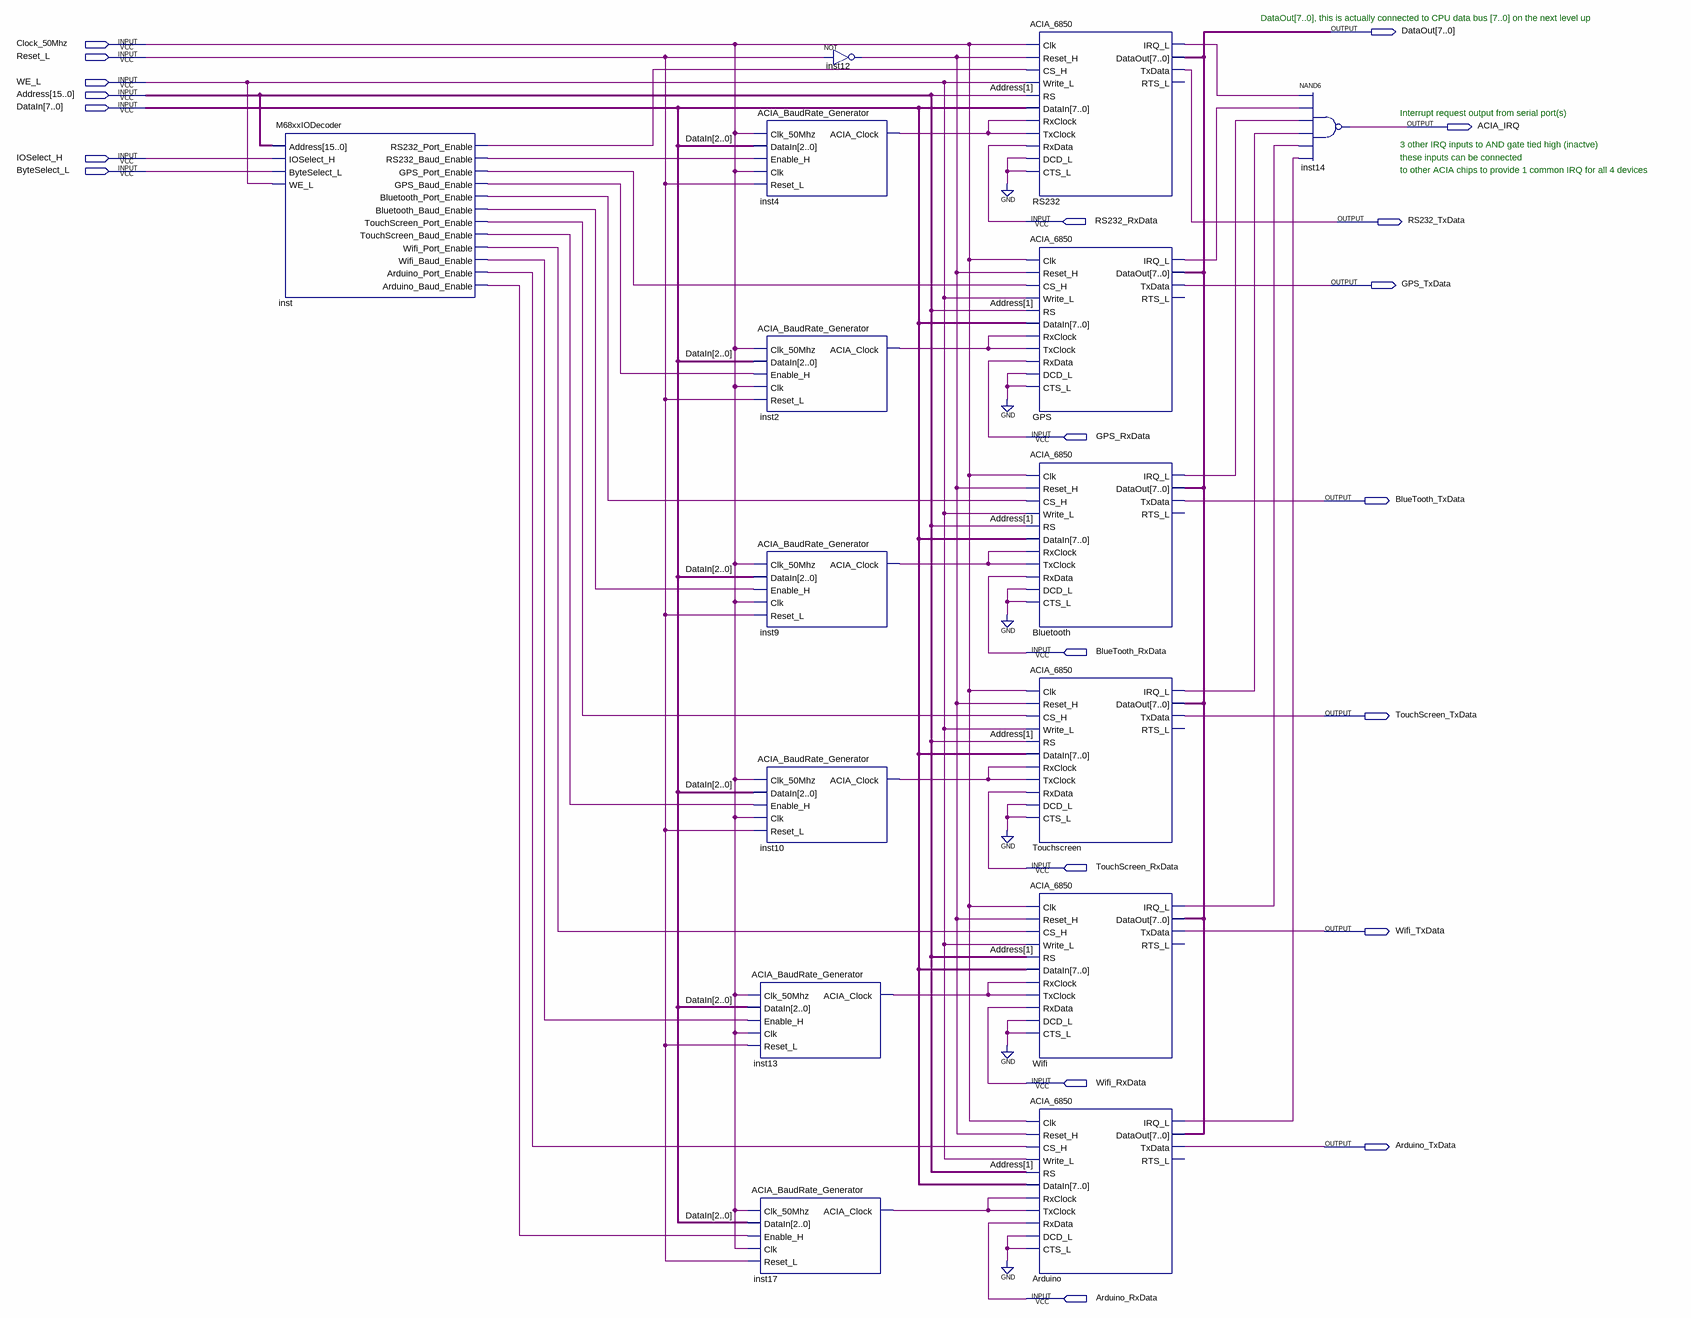
[diagram p0: schematic sheet]
// Quartus schematic OnChipM68xxIO.bdf as structural Verilog: 15 symbols, 21 pins
module OnChipM68xxIO (
  input  Clock_50Mhz,
  input  Reset_L,
  input  WE_L,
  input  [15:0] Address,
  input  [7:0] DataIn,
  input  IOSelect_H,
  input  ByteSelect_L,
  input  RS232_RxData,
  input  GPS_RxData,
  input  BlueTooth_RxData,
  input  TouchScreen_RxData,
  input  Wifi_RxData,
  input  Arduino_RxData,
  output [7:0] DataOut,
  output ACIA_IRQ,
  output RS232_TxData,
  output GPS_TxData,
  output BlueTooth_TxData,
  output TouchScreen_TxData,
  output Wifi_TxData,
  output Arduino_TxData
);

  wire Arduino_irq_l, Bluetooth_irq_l, GPS_irq_l, inst2_acia_clock, inst4_acia_clock, inst9_acia_clock,
       inst10_acia_clock, inst12_out, inst13_acia_clock, inst17_acia_clock, inst_arduino_baud_enable,
       inst_arduino_port_enable, inst_bluetooth_baud_enable, inst_bluetooth_port_enable,
       inst_gps_baud_enable, inst_gps_port_enable, inst_rs232_baud_enable, inst_rs232_port_enable,
       inst_touchscreen_baud_enable, inst_touchscreen_port_enable, inst_wifi_baud_enable,
       inst_wifi_port_enable, RS232_irq_l, Touchscreen_irq_l, Wifi_irq_l;

  M68xxIODecoder inst (
    .Address(Address), .IOSelect_H(IOSelect_H), .ByteSelect_L(ByteSelect_L), .WE_L(WE_L),
    .RS232_Port_Enable(inst_rs232_port_enable), .RS232_Baud_Enable(inst_rs232_baud_enable),
    .GPS_Port_Enable(inst_gps_port_enable), .GPS_Baud_Enable(inst_gps_baud_enable),
    .Bluetooth_Port_Enable(inst_bluetooth_port_enable), .Bluetooth_Baud_Enable(inst_bluetooth_baud_enable),
    .TouchScreen_Port_Enable(inst_touchscreen_port_enable),
    .TouchScreen_Baud_Enable(inst_touchscreen_baud_enable), .Wifi_Port_Enable(inst_wifi_port_enable),
    .Wifi_Baud_Enable(inst_wifi_baud_enable), .Arduino_Port_Enable(inst_arduino_port_enable),
    .Arduino_Baud_Enable(inst_arduino_baud_enable));
  ACIA_BaudRate_Generator inst4 (
    .Clk_50Mhz(Clock_50Mhz), .DataIn(DataIn[2:0]), .Enable_H(inst_rs232_baud_enable), .Clk(Clock_50Mhz),
    .Reset_L(Reset_L), .ACIA_Clock(inst4_acia_clock));
  ACIA_BaudRate_Generator inst2 (
    .Clk_50Mhz(Clock_50Mhz), .DataIn(DataIn[2:0]), .Enable_H(inst_gps_baud_enable), .Clk(Clock_50Mhz),
    .Reset_L(Reset_L), .ACIA_Clock(inst2_acia_clock));
  ACIA_BaudRate_Generator inst9 (
    .Clk_50Mhz(Clock_50Mhz), .DataIn(DataIn[2:0]), .Enable_H(inst_bluetooth_baud_enable), .Clk(Clock_50Mhz),
    .Reset_L(Reset_L), .ACIA_Clock(inst9_acia_clock));
  ACIA_BaudRate_Generator inst10 (
    .Clk_50Mhz(Clock_50Mhz), .DataIn(DataIn[2:0]), .Enable_H(inst_touchscreen_baud_enable),
    .Clk(Clock_50Mhz), .Reset_L(Reset_L), .ACIA_Clock(inst10_acia_clock));
  ACIA_BaudRate_Generator inst13 (
    .Clk_50Mhz(Clock_50Mhz), .DataIn(DataIn[2:0]), .Enable_H(inst_wifi_baud_enable), .Clk(Clock_50Mhz),
    .Reset_L(Reset_L), .ACIA_Clock(inst13_acia_clock));
  ACIA_BaudRate_Generator inst17 (
    .Clk_50Mhz(Clock_50Mhz), .DataIn(DataIn[2:0]), .Enable_H(inst_arduino_baud_enable), .Clk(Clock_50Mhz),
    .Reset_L(Reset_L), .ACIA_Clock(inst17_acia_clock));
  not inst12 (inst12_out, Reset_L);
  ACIA_6850 RS232 (
    .Clk(Clock_50Mhz), .Reset_H(inst12_out), .CS_H(inst_rs232_port_enable), .Write_L(WE_L), .RS(Address[1]),
    .DataIn(DataIn), .RxClock(inst4_acia_clock), .TxClock(inst4_acia_clock), .RxData(RS232_RxData),
    .DCD_L(1'b0), .CTS_L(1'b0), .IRQ_L(RS232_irq_l), .DataOut(DataOut), .TxData(RS232_TxData));  // open: RTS_L
  ACIA_6850 GPS (
    .Clk(Clock_50Mhz), .Reset_H(inst12_out), .CS_H(inst_gps_port_enable), .Write_L(WE_L), .RS(Address[1]),
    .DataIn(DataIn), .RxClock(inst2_acia_clock), .TxClock(inst2_acia_clock), .RxData(GPS_RxData),
    .DCD_L(1'b0), .CTS_L(1'b0), .IRQ_L(GPS_irq_l), .DataOut(DataOut), .TxData(GPS_TxData));  // open: RTS_L
  ACIA_6850 Bluetooth (
    .Clk(Clock_50Mhz), .Reset_H(inst12_out), .CS_H(inst_bluetooth_port_enable), .Write_L(WE_L),
    .RS(Address[1]), .DataIn(DataIn), .RxClock(inst9_acia_clock), .TxClock(inst9_acia_clock),
    .RxData(BlueTooth_RxData), .DCD_L(1'b0), .CTS_L(1'b0), .IRQ_L(Bluetooth_irq_l), .DataOut(DataOut),
    .TxData(BlueTooth_TxData));  // open: RTS_L
  ACIA_6850 Touchscreen (
    .Clk(Clock_50Mhz), .Reset_H(inst12_out), .CS_H(inst_touchscreen_port_enable), .Write_L(WE_L),
    .RS(Address[1]), .DataIn(DataIn), .RxClock(inst10_acia_clock), .TxClock(inst10_acia_clock),
    .RxData(TouchScreen_RxData), .DCD_L(1'b0), .CTS_L(1'b0), .IRQ_L(Touchscreen_irq_l), .DataOut(DataOut),
    .TxData(TouchScreen_TxData));  // open: RTS_L
  ACIA_6850 Wifi (
    .Clk(Clock_50Mhz), .Reset_H(inst12_out), .CS_H(inst_wifi_port_enable), .Write_L(WE_L), .RS(Address[1]),
    .DataIn(DataIn), .RxClock(inst13_acia_clock), .TxClock(inst13_acia_clock), .RxData(Wifi_RxData),
    .DCD_L(1'b0), .CTS_L(1'b0), .IRQ_L(Wifi_irq_l), .DataOut(DataOut), .TxData(Wifi_TxData));  // open: RTS_L
  ACIA_6850 Arduino (
    .Clk(Clock_50Mhz), .Reset_H(inst12_out), .CS_H(inst_arduino_port_enable), .Write_L(WE_L),
    .RS(Address[1]), .DataIn(DataIn), .RxClock(inst17_acia_clock), .TxClock(inst17_acia_clock),
    .RxData(Arduino_RxData), .DCD_L(1'b0), .CTS_L(1'b0), .IRQ_L(Arduino_irq_l), .DataOut(DataOut),
    .TxData(Arduino_TxData));  // open: RTS_L
  nand inst14 (ACIA_IRQ, RS232_irq_l, GPS_irq_l, Bluetooth_irq_l, Touchscreen_irq_l, Wifi_irq_l, Arduino_irq_l);

  // Notes on the sheet:
  //   DataOut[7..0], this is actually connected to CPU data bus [7..0] on the next level up
  //   Interrupt request output from serial port(s)
  //   3 other IRQ inputs to AND gate tied high (inactve)
  //   these inputs can be connected
  //   to other ACIA chips to provide 1 common IRQ for all 4 devices
endmodule
